# EAGLE design platform_smd2_map2 (EAGLE 6.5.0)
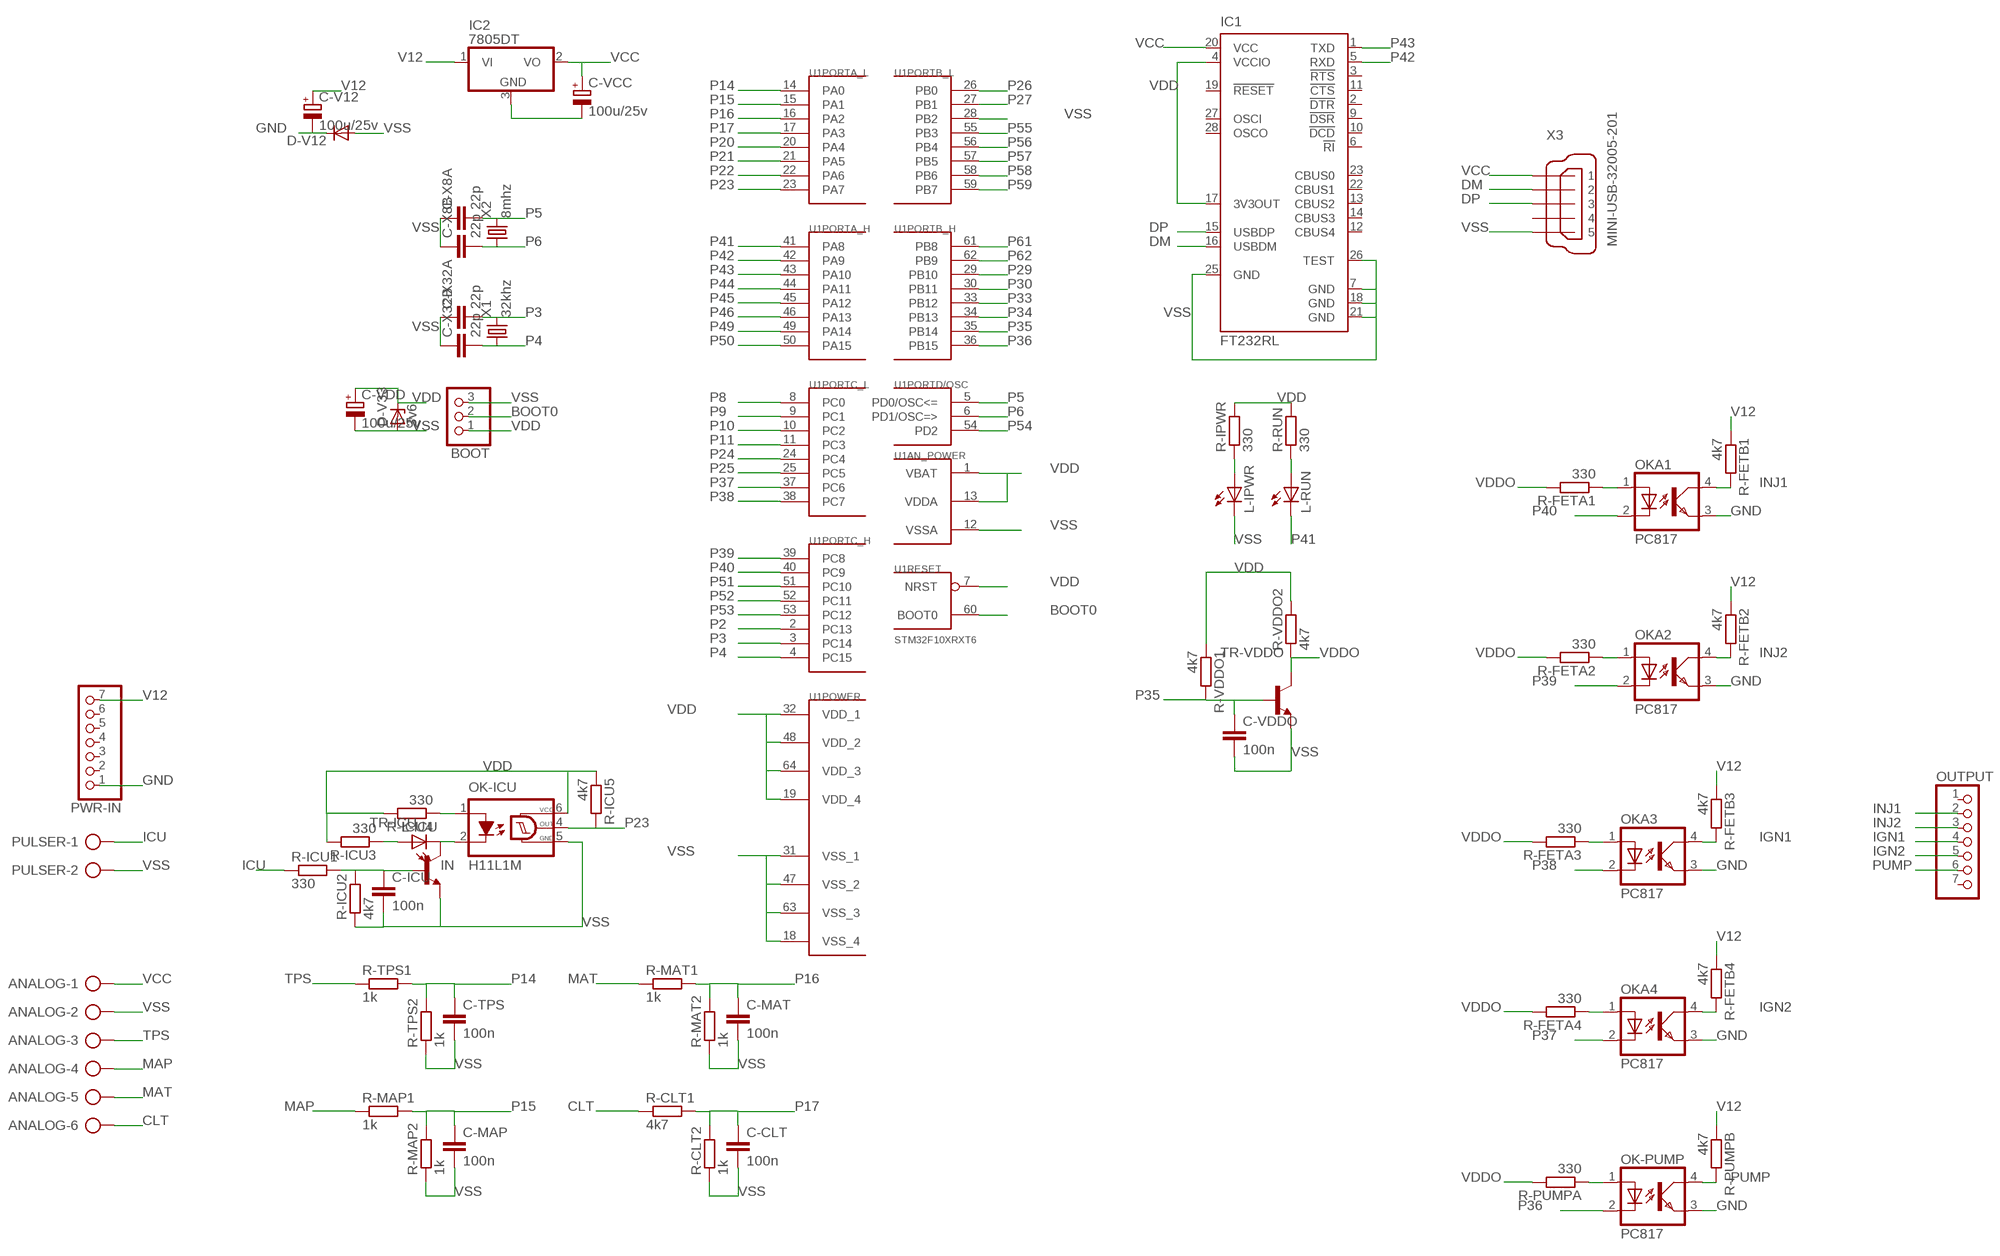
[diagram p0: schematic, sheet 1]

## Parts
ANALOG  AK300/6  [AK300/6]
BOOT  PINHD-1X3  [1X03]
C-CLT  100n  C-EUC1206  [C1206]
C-ICU  100n  C-EUC1206  [C1206]
C-MAP  100n  C-EUC1206  [C1206]
C-MAT  100n  C-EUC1206  [C1206]
C-TPS  100n  C-EUC1206  [C1206]
C-V12  100u/25v  CPOL-EUD  [PANASONIC_D]
C-VCC  100u/25v  CPOL-EUD  [PANASONIC_D]
C-VDD  100u/25v  CPOL-EUD  [PANASONIC_D]
C-VDDO  100n  C-EUC1206  [C1206]
C-X8A  22p  C-EUC1206  [C1206]
C-X8B  22p  C-EUC1206  [C1206]
C-X32A  22p  C-EUC1206  [C1206]
C-X32B  22p  C-EUC1206  [C1206]
D-V12  DIODE-SMB  [SMB]
D-V33  3v6  ZENER-DIODESMB  [SMB]
IC1  FT232RL  [SSOP28]
IC2  7805DT  [TO252]
L-ICU  LEDSMT1206  [1206]
L-IPWR  LEDSMT1206  [1206]
L-RUN  LEDSMT1206  [1206]
OK-ICU  H11L1M  [DIL06]
OK-PUMP  PC817  [DIL04]
OKA1  PC817  [DIL04]
OKA2  PC817  [DIL04]
OKA3  PC817  [DIL04]
OKA4  PC817  [DIL04]
OUTPUT  PINHD-1X7  [1X07]
PULSER  AK300/2  [AK300/2]
PWR-IN  PINHD-1X7  [1X07]
R-CLT1  4k7  R-EU_R1206  [R1206]
R-CLT2  1k  R-EU_R1206  [R1206]
R-FETA1  330  R-EU_R1206  [R1206]
R-FETA2  330  R-EU_R1206  [R1206]
R-FETA3  330  R-EU_R1206  [R1206]
R-FETA4  330  R-EU_R1206  [R1206]
R-FETB1  4k7  R-EU_R1206  [R1206]
R-FETB2  4k7  R-EU_R1206  [R1206]
R-FETB3  4k7  R-EU_R1206  [R1206]
R-FETB4  4k7  R-EU_R1206  [R1206]
R-ICU1  330  R-EU_R1206  [R1206]
R-ICU2  4k7  R-EU_R1206  [R1206]
R-ICU3  330  R-EU_R1206  [R1206]
R-ICU4  330  R-EU_R1206  [R1206]
R-ICU5  4k7  R-EU_R1206  [R1206]
R-IPWR  330  R-EU_R1206  [R1206]
R-MAP1  1k  R-EU_R1206  [R1206]
R-MAP2  1k  R-EU_R1206  [R1206]
R-MAT1  1k  R-EU_R1206  [R1206]
R-MAT2  1k  R-EU_R1206  [R1206]
R-PUMPA  330  R-EU_R1206  [R1206]
R-PUMPB  4k7  R-EU_R1206  [R1206]
R-RUN  330  R-EU_R1206  [R1206]
R-TPS1  1k  R-EU_R1206  [R1206]
R-TPS2  1k  R-EU_R1206  [R1206]
R-VDDO1  4k7  R-EU_M1206  [M1206]
R-VDDO2  4k7  R-EU_M1206  [M1206]
TR-ICU  MMBT3904LT1-NPN-SOT23-BEC  [SOT23-BEC]
TR-VDDO  MMBT3904LT1-NPN-SOT23-BEC  [SOT23-BEC]
U1  STM32F10XRXT6  [TQFP64]
X1  32khz  CRYSTALTC26V  [TC26V]
X2  8mhz  CRYSTALHC49U-V  [HC49U-V]
X3  MINI-USB-32005-201  [32005-201]

## Nets
BOOT0: BOOT.2 U1.60(RESET:BOOT0)
CLT: ANALOG.6 R-CLT1.1
DM: IC1.16(USBDM) X3.2
DP: IC1.15(USBDP) X3.3
GND: C-V12.- D-V12.C OK-PUMP.3(EMIT) OKA1.3(EMIT) OKA2.3(EMIT) OKA3.3(EMIT) OKA4.3(EMIT) PWR-IN.1
ICU: PULSER.1 R-ICU1.1
IGN1: OKA3.4(COL) OUTPUT.4 R-FETB3.2
IGN2: OKA4.4(COL) OUTPUT.5 R-FETB4.2
IN: L-ICU.C OK-ICU.2(C) TR-ICU.C
INJ1: OKA1.4(COL) OUTPUT.2 R-FETB1.2
INJ2: OKA2.4(COL) OUTPUT.3 R-FETB2.2
MAP: ANALOG.4 R-MAP1.1
MAT: ANALOG.5 R-MAT1.1
N$3: C-ICU.1 R-ICU1.2 R-ICU2.2 TR-ICU.B
N$5: OK-ICU.1(A) R-ICU4.1
N$6: L-ICU.A R-ICU3.1
N$7: L-IPWR.A R-IPWR.1
N$8: L-RUN.A R-RUN.1
N$9: OK-PUMP.1(A) R-PUMPA.1
N$12: OKA2.1(A) R-FETA2.1
N$13: OKA1.1(A) R-FETA1.1
N$15: OKA3.1(A) R-FETA3.1
N$17: OKA4.1(A) R-FETA4.1
P2: U1.2(PORTC_H:PC13)
P3: C-X32A.2 U1.3(PORTC_H:PC14) X1.2
P4: C-X32B.2 U1.4(PORTC_H:PC15) X1.1
P5: C-X8A.2 U1.5(PORTD/OSC:PD0/OSC<=) X2.2
P6: C-X8B.2 U1.6(PORTD/OSC:PD1/OSC=>) X2.1
P8: U1.8(PORTC_L:PC0)
P9: U1.9(PORTC_L:PC1)
P10: U1.10(PORTC_L:PC2)
P11: U1.11(PORTC_L:PC3)
P14: C-TPS.1 R-TPS1.2 R-TPS2.2 U1.14(PORTA_L:PA0)
P15: C-MAP.1 R-MAP1.2 R-MAP2.2 U1.15(PORTA_L:PA1)
P16: C-MAT.1 R-MAT1.2 R-MAT2.2 U1.16(PORTA_L:PA2)
P17: C-CLT.1 R-CLT1.2 R-CLT2.2 U1.17(PORTA_L:PA3)
P20: U1.20(PORTA_L:PA4)
P21: U1.21(PORTA_L:PA5)
P22: U1.22(PORTA_L:PA6)
P23: OK-ICU.4(OUT) R-ICU5.2 U1.23(PORTA_L:PA7)
P24: U1.24(PORTC_L:PC4)
P25: U1.25(PORTC_L:PC5)
P26: U1.26(PORTB_L:PB0)
P27: U1.27(PORTB_L:PB1)
P29: U1.29(PORTB_H:PB10)
P30: U1.30(PORTB_H:PB11)
P33: U1.33(PORTB_H:PB12)
P34: U1.34(PORTB_H:PB13)
P35: C-VDDO.1 R-VDDO1.2 TR-VDDO.B U1.35(PORTB_H:PB14)
P36: OK-PUMP.2(C) U1.36(PORTB_H:PB15)
P37: OKA4.2(C) U1.37(PORTC_L:PC6)
P38: OKA3.2(C) U1.38(PORTC_L:PC7)
P39: OKA2.2(C) U1.39(PORTC_H:PC8)
P40: OKA1.2(C) U1.40(PORTC_H:PC9)
P41: L-RUN.C U1.41(PORTA_H:PA8)
P42: IC1.5(RXD) U1.42(PORTA_H:PA9)
P43: IC1.1(TXD) U1.43(PORTA_H:PA10)
P44: U1.44(PORTA_H:PA11)
P45: U1.45(PORTA_H:PA12)
P46: U1.46(PORTA_H:PA13)
P49: U1.49(PORTA_H:PA14)
P50: U1.50(PORTA_H:PA15)
P51: U1.51(PORTC_H:PC10)
P52: U1.52(PORTC_H:PC11)
P53: U1.53(PORTC_H:PC12)
P54: U1.54(PORTD/OSC:PD2)
P55: U1.55(PORTB_L:PB3)
P56: U1.56(PORTB_L:PB4)
P57: U1.57(PORTB_L:PB5)
P58: U1.58(PORTB_L:PB6)
P59: U1.59(PORTB_L:PB7)
P61: U1.61(PORTB_H:PB8)
P62: U1.62(PORTB_H:PB9)
PUMP: OK-PUMP.4(COL) OUTPUT.6 R-PUMPB.2
TPS: ANALOG.3 R-TPS1.1
V12: C-V12.+ IC2.1(VI) PWR-IN.7 R-FETB1.1 R-FETB2.1 R-FETB3.1 R-FETB4.1 R-PUMPB.1
VCC: ANALOG.1 C-VCC.+ IC1.20(VCC) IC2.2(VO) X3.1
VDD: BOOT.1 C-VDD.+ D-V33.C IC1.4(VCCIO) IC1.17(3V3OUT) OK-ICU.6(VCC) R-ICU3.2 R-ICU4.2 R-ICU5.1 R-IPWR.2 R-RUN.2 R-VDDO1.1 R-VDDO2.2 U1.1(AN_POWER:VBAT) U1.7(RESET:NRST) U1.13(AN_POWER:VDDA) U1.19(POWER:VDD_4) U1.32(POWER:VDD_1) U1.48(POWER:VDD_2) U1.64(POWER:VDD_3)
VDDO: R-FETA1.2 R-FETA2.2 R-FETA3.2 R-FETA4.2 R-PUMPA.2 R-VDDO2.1 TR-VDDO.C
VSS: ANALOG.2 BOOT.3 C-CLT.2 C-ICU.2 C-MAP.2 C-MAT.2 C-TPS.2 C-VCC.- C-VDD.- C-VDDO.2 C-X8A.1 C-X8B.1 C-X32A.1 C-X32B.1 D-V12.A D-V33.A IC1.7(GND) IC1.18(GND) IC1.21(GND) IC1.25(GND) IC1.26(TEST) IC2.3(GND) L-IPWR.C OK-ICU.5(GND) PULSER.2 R-CLT2.1 R-ICU2.1 R-MAP2.1 R-MAT2.1 R-TPS2.1 TR-ICU.E TR-VDDO.E U1.12(AN_POWER:VSSA) U1.18(POWER:VSS_4) U1.28(PORTB_L:PB2) U1.31(POWER:VSS_1) U1.47(POWER:VSS_2) U1.63(POWER:VSS_3) X3.5
Unconnected: IC1.2(!DTR) IC1.3(!RTS) IC1.6(!RI) IC1.9(!DSR) IC1.10(!DCD) IC1.11(!CTS) IC1.12(CBUS4) IC1.13(CBUS2) IC1.14(CBUS3) IC1.19(!RESET) IC1.22(CBUS1) IC1.23(CBUS0) IC1.27(OSCI) IC1.28(OSCO) OUTPUT.1 OUTPUT.7 PWR-IN.2 PWR-IN.3 PWR-IN.4 PWR-IN.5 PWR-IN.6 X3.4

## Library data of the parts
ANALOG = con-ptr500:AK300/6: CONNECTOR; OC_FARNELL: unknown; OC_NEWARK: unknown
BOOT = pinhead:PINHD-1X3: PIN HEADER
C-CLT C-ICU C-MAP C-MAT C-TPS C-VDDO C-X8A C-X8B C-X32A C-X32B = resistor:C-EU: CAPACITOR, European symbol
C-V12 C-VCC C-VDD = resistor:CPOL-EU: POLARIZED CAPACITOR, European symbol
D-V12 = diode:DIODE-: DIODE
D-V33 = diode:ZENER-DIODE: Z-Diode
IC1 = ftdichip:FT232R: Source: http://www.ftdichip.com/Documents/DataSheets/DS_FT232R_v104.pdf; MPN: FT232RL; OC_FARNELL: 1146032; OC_NEWARK: 91K9918
IC2 = linear:78*: Positive VOLTAGE REGULATOR Source: http://cache.national.com/ds/LM/LM78L05.pdf http://www.fairchildsemi.com/ds/LM/LM7805.pdf
L-ICU L-IPWR L-RUN = led:LED: LED OSRAM: - CHIPLED LG R971, LG N971, LY N971, LG Q971, LY Q971, LO R971, LY R971 LH N974, LH R974 LS Q976, LO Q976, LY Q976 LO Q996 - Hyper CHIPLED LW Q18S LB Q993, LB Q99A, LB R99A - SideLED LS A670, LO A670, LY A670, LG A670, LP A670 LB A673, LV A673, LT A673, LW A673 LH A674 LY A675 LS A676, LA A676, LO A676, LY A676, LW A676 LS A679, LY A679, LG A679 - Hyper Micro SIDELED® LS Y876, LA Y876, LO Y876, LY Y876 LT Y87S - SmartLED LW L88C, LW L88S LB L89C, LB L89S, LG L890 LS L89K, LO L89K, LY L89K LS L896, LA L896, LO L896, LY L896 - TOPLED LS T670, LO T670, LY T670, LG T670, LP T670 LSG T670, LSP T670, LSY T670, LOP T670, LYG T670 LG T671, LOG T671, LSG T671 LB T673, LV T673, LT T673, LW T673 LH T674 LS T676, LA T676, LO T676, LY T676, LB T676, LH T676, LSB T676, LW T676 LB T67C, LV T67C, LT T67C, LS T67K, LO T67K, LY T67K, LW E67C LS E67B, LA E67B, LO E67B, LY E67B, LB E67C, LV E67C, LT E67C LW T67C LS T679, LY T679, LG T679 LS T770, LO T770, LY T770, LG T770, LP T770 LB T773, LV T773, LT T773, LW T773 LH T774 LS E675, LA E675, LY E675, LS T675 LS T776, LA T776, LO T776, LY T776, LB T776 LHGB T686 LT T68C, LB T68C - Hyper Mini TOPLED® LB M676 - Mini TOPLED Santana® LG M470 LS M47K, LO M47K, LY M47K Source: http://www.osram.convergy.de LUXEON: - LUMILED® LXK2-PW12-R00, LXK2-PW12-S00, LXK2-PW14-U00, LXK2-PW14-V00 LXK2-PM12-R00, LXK2-PM12-S00, LXK2-PM14-U00 LXK2-PE12-Q00, LXK2-PE12-R00, LXK2-PE12-S00, LXK2-PE14-T00, LXK2-PE14-U00 LXK2-PB12-K00, LXK2-PB12-L00, LXK2-PB12-M00, LXK2-PB14-N00, LXK2-PB14-P00, LXK2-PB14-Q00 LXK2-PR12-L00, LXK2-PR12-M00, LXK2-PR14-Q00, LXK2-PR14-R00 LXK2-PD12-Q00, LXK2-PD12-R00, LXK2-PD12-S00 LXK2-PH12-R00, LXK2-PH12-S00 LXK2-PL12-P00, LXK2-PL12-Q00, LXK2-PL12-R00 Source: www.luxeon.com KINGBRIGHT: KA-3528ASYC Source: www.kingbright.com
OK-ICU = optocoupler:H11L*M: 6-Pin DIP Optocoupler Source: http://www.fairchildsemi.com/ds/H1/H11L2-M.pdf; MF: FAIRCHILD SEMICONDUCTOR; MPN: H11L1-M; OC_FARNELL: 1021127; OC_NEWARK: 72K8643
OK-PUMP OKA1-OKA4 = optocoupler:PC817: SHARP OPTO COUPLER; MPN: PC817X4J000F; OC_FARNELL: 9707727; OC_NEWARK: 97K7059
OUTPUT PWR-IN = pinhead:PINHD-1X7: PIN HEADER
PULSER = con-ptr500:AK300/2: CONNECTOR; OC_FARNELL: unknown; OC_NEWARK: unknown
R-CLT1 R-CLT2 R-FETA1-R-FETA4 R-FETB1-R-FETB4 R-ICU1-R-ICU5 R-IPWR R-MAP1 R-MAP2 R-MAT1 R-MAT2 R-PUMPA R-PUMPB R-RUN R-TPS1 R-TPS2 R-VDDO1 R-VDDO2 = resistor:R-EU_: RESISTOR, European symbol
TR-ICU TR-VDDO = transistor:*-NPN-: NPN Transistror BF959 corrected 2008.03.06
U1 = stm32:STM32F10XRXT6: STM32F101/103 64pin LQFP
X1 = crystal:CRYSTAL: CRYSTAL; OC_FARNELL: unknown; OC_NEWARK: unknown
X2 = crystal:CRYSTAL: CRYSTAL; OC_FARNELL: 1666969; OC_NEWARK: unknown
X3 = con-cypressindustries:MINI-USB-: MINI USB-B Conector Source: www.cypressindustries.com; OC_FARNELL: unknown; OC_NEWARK: unknown

## Board
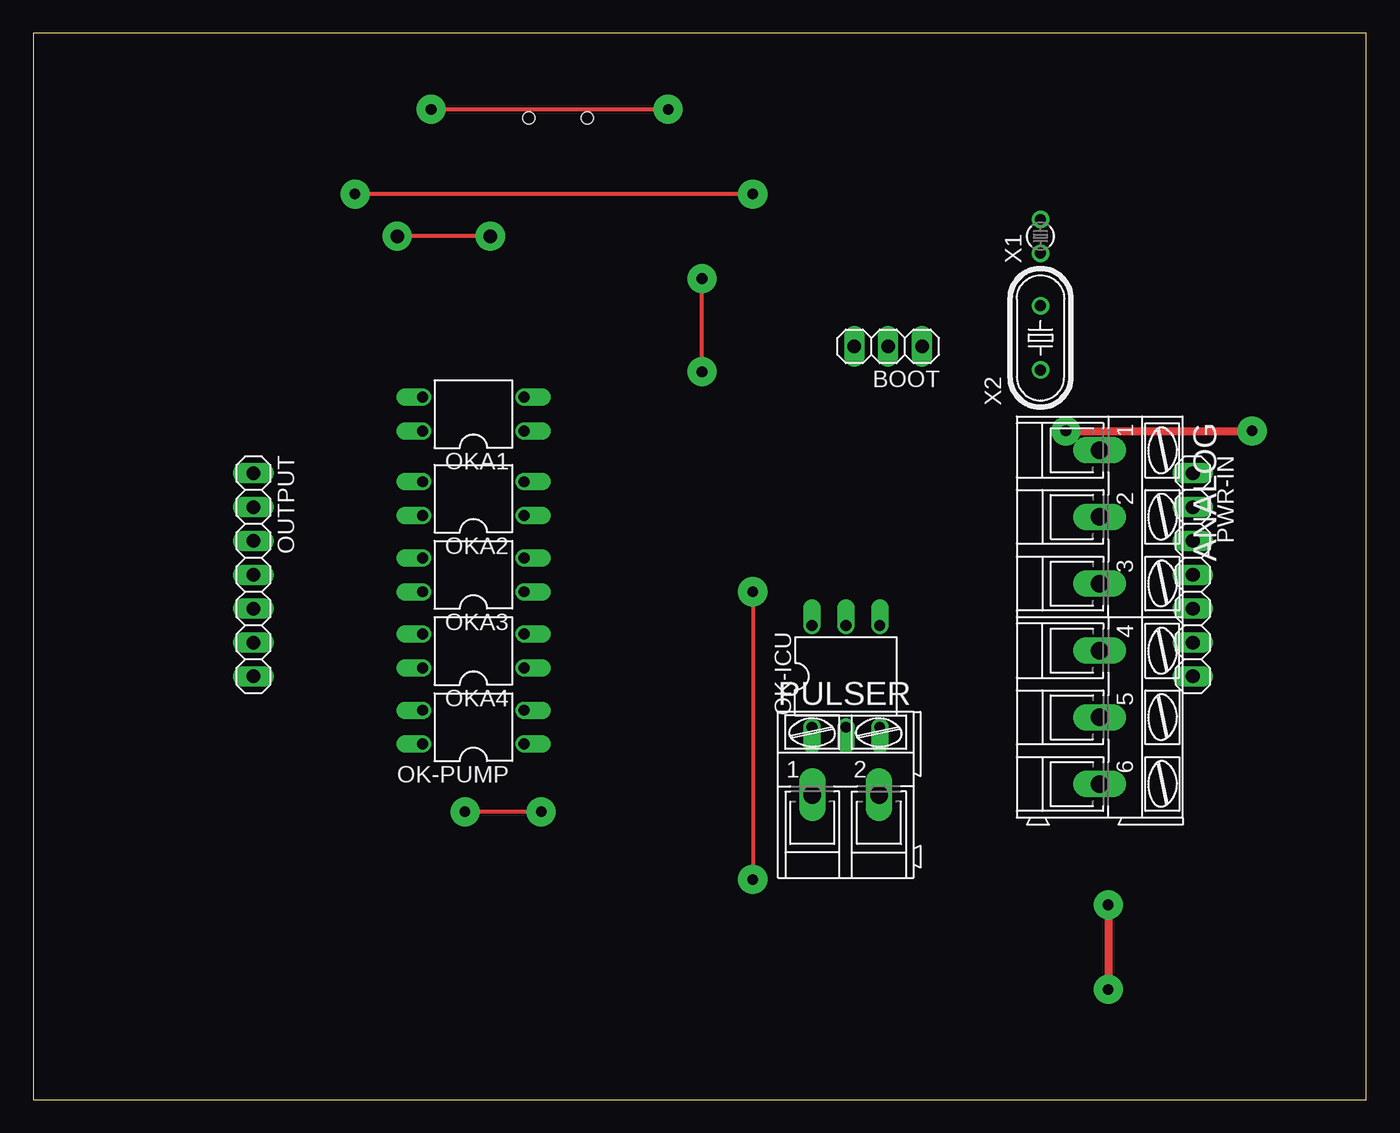
[diagram p1: board, top side]
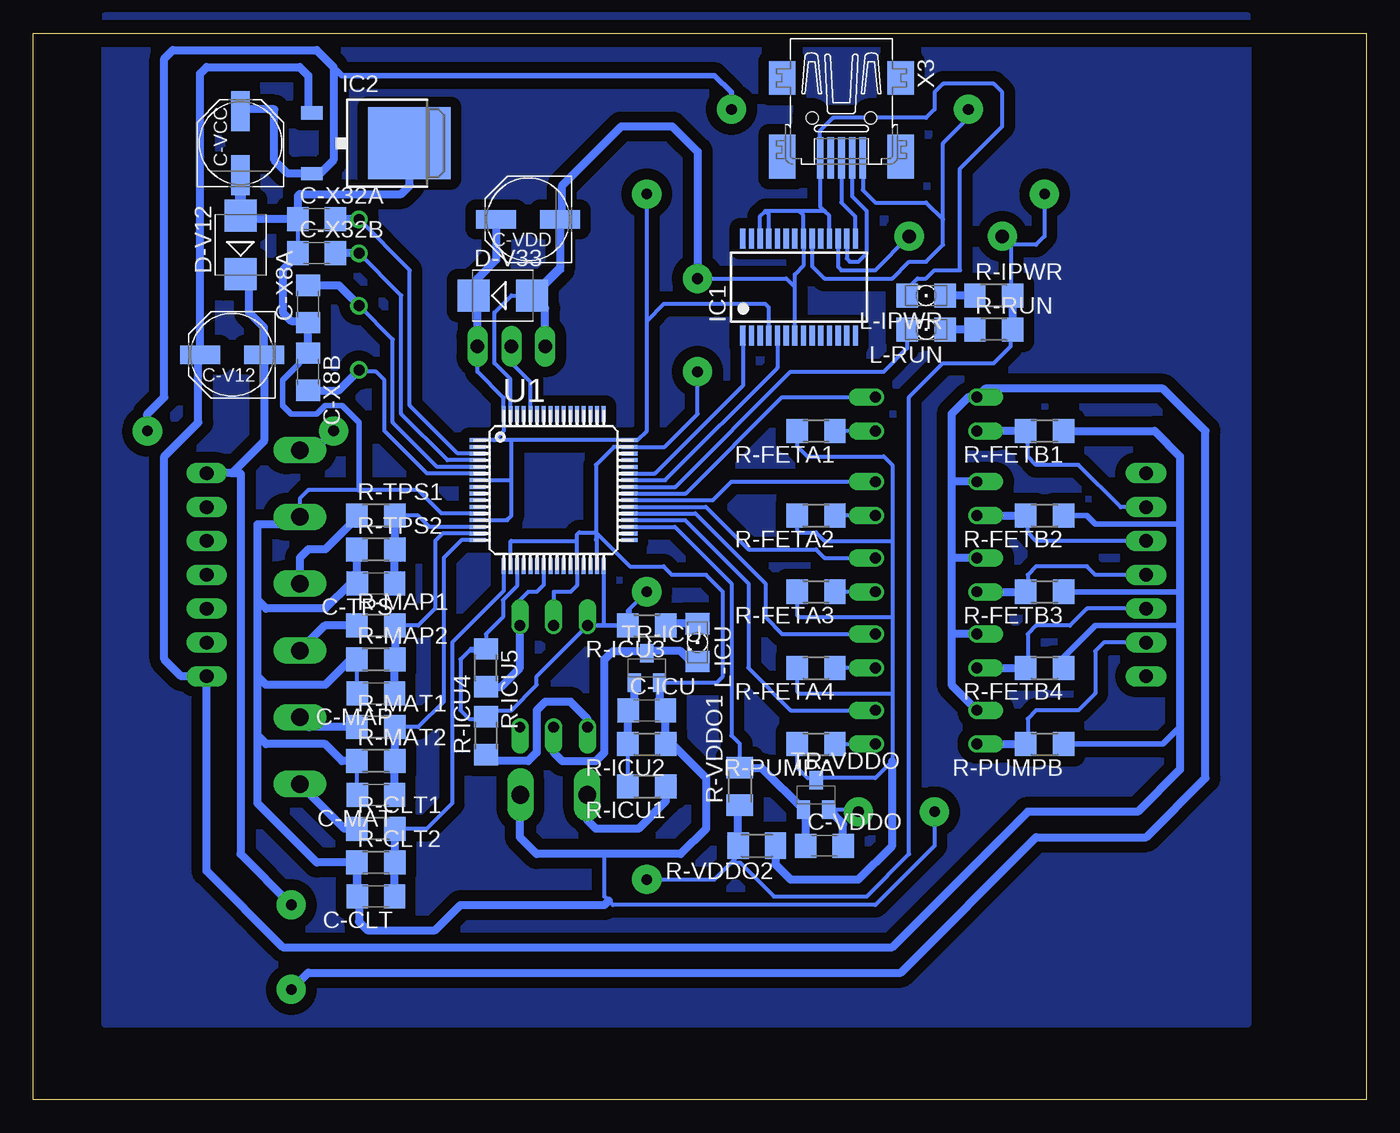
[diagram p2: board, bottom side, seen from below]

Size 100 x 80 mm. Coordinates in mm from the lower left corner, seen from the top.
Outline: 0,0 100,0 100,80 0,80 0,0
Copper layers (1*16): Top 0.035mm / dielectric 1.5mm / Bottom 0.035mm
Design rules "default": minimum track width 10mil, minimum drill 24mil, track to track 8mil, track to pad 8mil, pad to pad 8mil, via to via 8mil, smd to smd 8mil, copper to edge 40mil, drill to drill 8mil, minimum pad ring 10mil, minimum via ring 8mil, stop-mask expansion 4mil, vias tented up to drill 0mil, thermal gap 10mil

### Footprints (pad centres in the part's own frame; a part is rotated, then mirrored left to right if it is on the bottom)
AK300/6 = drill 1.321 long: 1 -12.522,0; 2 -7.518,0; 3 -2.515,0; 4 2.515,0; 5 7.518,0; 6 12.522,0
1X03 = drill 1.016 long: 1 -2.54,0; 2 0,0; 3 2.54,0
C1206 = smd 1.6 x 1.8: 1 -1.4,0; 2 1.4,0
PANASONIC_D = smd 3 x 1.4: + 2.4,0; - -2.4,0
SMB = smd 2.4 x 2.4: A 2.2,0; C -2.2,0
SSOP28 = smd 0.4 x 1.5: 1 -4.225,-3.625; 2 -3.575,-3.625; 3 -2.925,-3.625; 4 -2.275,-3.625; 5 -1.625,-3.625; 6 -0.975,-3.625; 7 -0.325,-3.625; 8 0.325,-3.625; 9 0.975,-3.625; 10 1.625,-3.625; 11 2.275,-3.625; 12 2.925,-3.625; 13 3.575,-3.625; 14 4.225,-3.625; 15 4.225,3.625; 16 3.575,3.625; 17 2.925,3.625; 18 2.275,3.625; 19 1.625,3.625; 20 0.975,3.625; 21 0.325,3.625; 22 -0.325,3.625; 23 -0.975,3.625; 24 -1.625,3.625; 25 -2.275,3.625; 26 -2.925,3.625; 27 -3.575,3.625; 28 -4.225,3.625
TO252 = smd 1 x 1.6: 1 -2.28,-4.8; 2 2.28,-4.8 | smd 5.4 x 6.2: 3 0,2.5
1206 = smd 1.6 x 1.803: A -1.422,0; C 1.422,0
DIL06 = drill 0.813 offset: 1 -2.54,-3.81; 2 0,-3.81; 3 2.54,-3.81; 4 2.54,3.81; 5 0,3.81; 6 -2.54,3.81
DIL04 = drill 0.813 offset: 1 -1.27,-3.81; 2 1.27,-3.81; 3 1.27,3.81; 4 -1.27,3.81
1X07 = drill 1.016 long: 1 -7.62,0; 2 -5.08,0; 3 -2.54,0; 4 0,0; 5 2.54,0; 6 5.08,0; 7 7.62,0
AK300/2 = drill 1.321 long: 1 -2.515,0; 2 2.489,0
R1206 = smd 1.6 x 1.803: 1 -1.422,0; 2 1.422,0
M1206 = smd 1.6 x 2: 1 -1.4,0; 2 1.4,0
SOT23-BEC = smd 1 x 1.4: B -0.95,-1.1; C 0,1.1; E 0.95,-1.1
TQFP64 = smd 1.2 x 0.3: 1 -5.7,3.75; 2 -5.7,3.25; 3 -5.7,2.75; 4 -5.7,2.25; 5 -5.7,1.75; 6 -5.7,1.25; 7 -5.7,0.75; 8 -5.7,0.25; 9 -5.7,-0.25; 10 -5.7,-0.75; 11 -5.7,-1.25; 12 -5.7,-1.75; 13 -5.7,-2.25; 14 -5.7,-2.75; 15 -5.7,-3.25; 16 -5.7,-3.75; 33 5.7,-3.75; 34 5.7,-3.25; 35 5.7,-2.75; 36 5.7,-2.25; 37 5.7,-1.75; 38 5.7,-1.25; 39 5.7,-0.75; 40 5.7,-0.25; 41 5.7,0.25; 42 5.7,0.75; 43 5.7,1.25; 44 5.7,1.75; 45 5.7,2.25; 46 5.7,2.75; 47 5.7,3.25; 48 5.7,3.75 | smd 0.3 x 1.2: 17 -3.75,-5.7; 18 -3.25,-5.7; 19 -2.75,-5.7; 20 -2.25,-5.7; 21 -1.75,-5.7; 22 -1.25,-5.7; 23 -0.75,-5.7; 24 -0.25,-5.7; 25 0.25,-5.7; 26 0.75,-5.7; 27 1.25,-5.7; 28 1.75,-5.7; 29 2.25,-5.7; 30 2.75,-5.7; 31 3.25,-5.7; 32 3.75,-5.7; 49 3.75,5.7; 50 3.25,5.7; 51 2.75,5.7; 52 2.25,5.7; 53 1.75,5.7; 54 1.25,5.7; 55 0.75,5.7; 56 0.25,5.7; 57 -0.25,5.7; 58 -0.75,5.7; 59 -1.25,5.7; 60 -1.75,5.7; 61 -2.25,5.7; 62 -2.75,5.7; 63 -3.25,5.7; 64 -3.75,5.7
TC26V = drill 0.813: 1 -1.27,0; 2 1.27,0
HC49U-V = drill 0.813: 1 -2.413,0; 2 2.413,0
32005-201 = smd 3.1 x 0.5: 1 3,1.6; 2 3,0.8; 3 3,0; 4 3,-0.8; 5 3,-1.6 | smd 2.5 x 2: M1 -3,-4.45; M2 -3,4.45 | smd 3.3 x 2: M3 2.9,4.45; M4 2.9,-4.45 | hole 0.9: 0,2.2; 0,-2.2

### Placement (x,y rotation side)
ANALOG  80.01,36.2 270 top
BOOT  64.14,56.52 180 top
C-CLT  74.3,15.24 180 bottom
C-ICU  53.98,29.21 0 bottom
C-MAP  74.3,30.48 180 bottom
C-MAT  74.3,22.86 180 bottom
C-TPS  74.3,38.73 180 bottom
C-V12  85.09,55.88 180 bottom
C-VCC  84.45,71.75 90 bottom
C-VDD  62.87,66.04 180 bottom
C-VDDO  40.64,19.05 0 bottom
C-X8A  79.38,59.69 90 bottom
C-X8B  79.38,54.61 270 bottom
C-X32A  78.74,66.04 0 bottom
C-X32B  78.74,63.5 0 bottom
D-V12  84.45,64.14 90 bottom
D-V33  64.77,60.33 0 bottom
IC1  42.55,60.96 0 bottom
IC2  74.3,71.75 270 bottom
L-ICU  50.16,34.29 270 bottom
L-IPWR  33.02,60.33 180 bottom
L-RUN  33.02,57.78 180 bottom
OK-ICU  60.96,31.75 0 top
OK-PUMP  33.02,27.94 90 top
OKA1  33.02,51.44 90 top
OKA2  33.02,45.09 90 top
OKA3  33.02,39.37 90 top
OKA4  33.02,33.66 90 top
OUTPUT  16.51,39.37 270 top
PULSER  60.96,22.86 0 top
PWR-IN  87,39.37 270 top
R-CLT1  74.3,20.32 0 bottom
R-CLT2  74.3,17.78 0 bottom
R-FETA1  41.27,50.16 180 bottom
R-FETA2  41.27,43.81 180 bottom
R-FETA3  41.27,38.1 180 bottom
R-FETA4  41.27,32.38 180 bottom
R-FETB1  24.13,50.16 180 bottom
R-FETB2  24.13,43.81 180 bottom
R-FETB3  24.13,38.1 180 bottom
R-FETB4  24.13,32.38 180 bottom
R-ICU1  53.98,23.5 180 bottom
R-ICU2  53.98,26.67 180 bottom
R-ICU3  53.98,35.56 180 bottom
R-ICU4  66.04,27.3 90 bottom
R-ICU5  66.04,32.38 270 bottom
R-IPWR  27.94,60.33 0 bottom
R-MAP1  74.3,35.56 0 bottom
R-MAP2  74.3,33.02 0 bottom
R-MAT1  74.3,27.94 0 bottom
R-MAT2  74.3,25.4 0 bottom
R-PUMPA  41.27,26.67 180 bottom
R-PUMPB  24.13,26.67 180 bottom
R-RUN  27.94,57.78 0 bottom
R-TPS1  74.3,43.81 0 bottom
R-TPS2  74.3,41.27 0 bottom
R-VDDO1  46.99,23.5 90 bottom
R-VDDO2  45.72,19.05 180 bottom
TR-ICU  53.98,32.38 0 bottom
TR-VDDO  41.27,22.86 0 bottom
U1  60.96,45.72 0 bottom
X1  75.56,64.77 90 top
X2  75.56,57.15 90 top
X3  39.37,73.66 270 bottom

### Tracks (layer width: path | path; a pad name or v marks a point on that pad's centre or on a via)
BOOT0
  Bottom 0.305: U1.60 62.71,53.82 64.14,55.24 BOOT.2
CLT
  Bottom 0.61: R-CLT1.1 76.66,20.32 ANALOG.6
DM
  Bottom 0.305: X3.2 38.57,67.78 37.47,66.67 37.47,63.5 38.1,62.87 38.73,62.87 38.97,63.1 IC1.16
DP
  Bottom 0.305: X3.3 39.37,67.31 38.32,66.26 IC1.15
GND  (via drill 0.8 pad 2.18)
  Top 0.61: v80.64,14.61 v80.64,8.26
  Bottom 0.61: 31.11,46.35 31.11,51.44 29.84,52.7 OKA1.3 28.57,53.34 15.24,53.34 12.06,50.16 12.06,24.13 16.51,19.68 24.77,19.68 34.92,9.53 79.38,9.53 v80.64,8.26 | 31.11,46.35 31.11,40.64 | 31.11,40.64 31.11,34.92 | 31.11,34.92 31.11,31.11 OK-PUMP.3 | OKA4.3 31.11,34.92 | OKA3.3 31.11,40.64 | OKA2.3 31.11,46.35 | D-V12.C 83.82,61.3 83.82,59.05 82.69,57.92 C-V12.- 82.69,49.39 85.09,46.99 | 85.09,46.99 PWR-IN.1 | 85.09,46.99 84.45,46.99 84.45,18.41 v80.64,14.61
ICU
  Bottom 0.61: R-ICU1.1 52.55,22.38 54.61,20.32 57.78,20.32 58.42,20.95 58.42,22.84 PULSER.1
IGN1
  Bottom 0.305: OUTPUT.4 20.32,39.37 20.95,40.01 24.77,40.01 25.4,39.37 25.4,37.95 | 25.4,37.47 25.4,37.95 | 25.4,37.95 R-FETB3.2
  Bottom 0.61: OKA3.4 R-FETB3.2
IGN2
  Bottom 0.305: OUTPUT.5 20.95,36.83 22.23,35.56 24.77,35.56 25.4,34.92 25.4,32.54 R-FETB4.2
  Bottom 0.61: OKA4.4 R-FETB4.2
IN
  Bottom 0.61: L-ICU.C 50.65,32.87 51.44,33.66 53.8,33.66 TR-ICU.C 54.15,33.66 56.52,33.66 57.15,33.02 57.15,26.04 57.78,25.4 60.33,25.4 60.96,26.04 OK-ICU.2
INJ1
  Bottom 0.305: OUTPUT.2 18.41,44.45 21.59,47.62 24.77,47.62 25.4,48.26 25.4,50.01 R-FETB1.2
  Bottom 0.61: R-FETB1.2 OKA1.4
INJ2
  Bottom 0.305: OUTPUT.3 24.77,41.91 25.4,42.55 25.4,43.66 R-FETB2.2
  Bottom 0.61: OKA2.4 R-FETB2.2
MAP
  Bottom 0.61: R-MAP1.1 78.13,35.56 ANALOG.4
MAT
  Bottom 0.61: R-MAT1.1 79.27,27.94 ANALOG.5
N$1
  pour Bottom (isolate 0.813): 8.89,81.28 94.61,81.28 94.61,5.71 8.89,5.71
N$3
  Bottom 0.305: R-ICU1.2 R-ICU2.2
  Bottom 0.61: TR-ICU.B 54.92,29.66 C-ICU.1 55.4,29.19 R-ICU2.2
N$5
  Bottom 0.61: OK-ICU.1 58.42,28.57 59.69,29.84 61.59,29.84 62.23,29.21 62.23,26.04 62.87,25.4 65.56,25.4 R-ICU4.1
N$6
  Bottom 0.61: L-ICU.A 52.4,35.71 R-ICU3.1
N$7
  Bottom 0.61: R-IPWR.1 L-IPWR.A
N$8
  Bottom 0.61: R-RUN.1 L-RUN.A
N$9
  Bottom 0.305: R-PUMPA.1 OK-PUMP.1
N$12
  Bottom 0.305: OKA2.1 R-FETA2.1
N$13
  Bottom 0.305: OKA1.1 R-FETA1.1
N$15
  Bottom 0.305: OKA3.1 R-FETA3.1
N$17
  Bottom 0.305: OKA4.1 R-FETA4.1
P3
  Bottom 0.305: U1.3 68.16,48.47 71.75,52.07 71.75,62.23 X1.2
  Bottom 0.61: X1.2 C-X32A.2
P4
  Bottom 0.305: U1.4 68.92,47.97 72.39,51.44 72.39,60.33 X1.1
  Bottom 0.61: X1.1 C-X32B.2
P5
  Bottom 0.305: U1.5 69.69,47.47 73.03,50.8 73.03,57.02 X2.2
  Bottom 0.61: C-X8A.2 77.09,61.09 X2.2
P6
  Bottom 0.305: U1.6 70.47,46.97 73.66,50.16 73.66,53.98 74.3,54.61 75.44,54.61 X2.1
  Bottom 0.61: C-X8B.2 77.09,53.21 X2.1
P14
  Bottom 0.305: U1.14 70.28,42.97 71.12,43.81 R-TPS1.2
  Bottom 0.61: C-TPS.1 72.89,41.25 R-TPS2.2 R-TPS1.2
P15
  Bottom 0.305: U1.15 69.29,42.47 69.85,41.91 69.85,36.83 71.12,35.56 R-MAP1.2
  Bottom 0.61: C-MAP.1 72.89,33.52 | 72.89,33.52 73.03,33.66 | R-MAP1.2 R-MAP2.2 72.87,33.5 72.89,33.52
P16
  Bottom 0.305: U1.16 67.89,41.97 69.22,40.64 69.22,29.84 71.12,27.94 R-MAT1.2
  Bottom 0.61: C-MAT.1 72.89,25.38 R-MAT2.2 R-MAT1.2 | R-MAT1.2 72.87,28.42 73.03,28.57 73.03,28.09 R-MAT1.2
P17
  Bottom 0.305: U1.17 64.71,38.16 68.58,34.29 68.58,22.23 70.48,20.32 R-CLT1.2
  Bottom 0.61: C-CLT.1 72.89,17.76 R-CLT2.2 R-CLT1.2
P23
  Bottom 0.305: U1.23 61.71,38.62 62.23,38.1 62.87,38.1 63.5,37.47 OK-ICU.4
  Bottom 0.61: R-ICU5.2 64.92,30.96 63.5,32.38 OK-ICU.4
P35
  Bottom 0.305: U1.35 51.86,42.97 47.62,38.73 47.62,27.3 46.99,26.67 R-VDDO1.2
  Bottom 0.61: C-VDDO.1 42.04,21.57 TR-VDDO.B 45.36,24.89 R-VDDO1.2
P36
  Bottom 0.305: U1.36 51.09,43.47 46.35,38.73 46.35,32.38 43.18,29.21 OK-PUMP.2
P37
  Bottom 0.305: U1.37 50.32,43.97 45.09,38.73 45.09,36.2 43.81,34.92 OKA4.2
P38
  Bottom 0.305: U1.38 49.55,44.47 46.35,41.27 41.27,41.27 40.64,40.64 OKA3.2
P39
  Bottom 0.305: U1.39 49.01,44.97 47.62,46.35 OKA2.2
P40
  Bottom 0.305: U1.40 51.05,45.47 43.81,52.7 OKA1.2
P41
  Bottom 0.305: 34.29,57.63 L-RUN.C 34.44,56.36 36.2,54.61 43.18,54.61 51.82,45.97 U1.41
P42
  Bottom 0.305: U1.42 52.59,46.47 44.17,54.89 IC1.5
P43
  Bottom 0.305: U1.43 53.36,46.97 46.77,53.56 IC1.1
PUMP
  Bottom 0.305: OUTPUT.6 19.68,34.29 20.32,33.66 20.32,30.48 21.59,29.21 24.77,29.21 25.4,28.57 25.4,26.82 R-PUMPB.2
  Bottom 0.61: OK-PUMP.4 R-PUMPB.2
TPS
  Bottom 0.61: R-TPS1.1 75.72,43.66 78.11,41.27 79.38,41.27 80.01,40.64 ANALOG.3
V12
  Bottom 0.406: 13.97,48.26 13.97,43.18 | 13.97,43.18 13.97,38.1 | 13.97,38.1 13.97,35.56 | 13.97,35.56 13.97,27.94 15.24,26.67 R-PUMPB.1 | R-FETB4.1 22.71,33.17 20.32,35.56 13.97,35.56 | R-FETB3.1 13.97,38.1 | R-FETB2.1 20.95,43.81 20.32,43.18 13.97,43.18
  Bottom 0.61: PWR-IN.7 87.63,31.75 | 87.63,31.75 88.9,31.75 90.17,33.02 90.17,48.26 87.63,50.8 87.63,55.74 C-V12.+ 87.49,76.97 87,77.47 80.01,77.47 79.38,76.83 79.38,74.31 IC2.1 | R-FETB1.1 15.88,50.16 13.97,48.26 13.97,24.77 17.14,21.59 25.4,21.59 35.56,11.43 81.28,11.43 87,17.14 87,31.11 87.63,31.75
VCC  (via drill 0.8 pad 2.18)
  Top 0.305: v29.84,74.3 v47.62,74.3
  Top 0.61: v77.47,50.16 v91.44,50.16
  Bottom 0.305: X3.1 37.77,68.25 36.83,67.31 33.02,67.31 31.75,66.04 | IC1.20 41.57,62.52 40.64,61.59 35.56,61.59 34.29,62.87 33.02,62.87 31.75,64.14 31.75,66.04 | 31.75,66.04 31.75,71.75 29.84,73.66 v29.84,74.3
  Bottom 0.406: v47.62,74.3 47.62,75.56 48.9,76.83 76.83,76.83 77.47,77.47
  Bottom 0.61: C-VCC.+ 84.31,74.3 81.92,74.3 81.92,70.48 80.91,69.47 IC2.2 78.48,69.47 77.47,70.48 77.47,77.47 78.74,78.74 89.53,78.74 90.17,78.11 90.17,52.7 91.44,51.44 v91.44,50.16 | ANALOG.1 78.92,48.72 v77.47,50.16
VDD  (via drill 0.7 pad 2.18, 0.8 pad 2.18, 1)
  Top 0.305: v34.29,64.77 v27.3,64.77 | v53.98,67.94 v24.13,67.94 | v53.98,38.1 v53.98,16.51
  Bottom 0.305: 57.15,35.56 R-ICU3.2 55.4,36.68 55.24,36.83 | 57.15,35.56 OK-ICU.6 | 66.04,34.29 R-ICU5.1 67.16,33.81 67.31,33.66 | U1.32 57.21,35.62 57.15,35.56 | 66.19,28.57 67.31,28.57 67.94,29.21 67.94,33.02 67.31,33.66 | 66.19,28.57 R-ICU4.2 65.56,29.21 65.41,29.21 | BOOT.1 66.67,54.61 64.71,52.65 U1.64 64.71,50.16 65.41,49.47 | IC1.17 39.62,62.48 39.37,62.23 36.83,62.23 v34.29,64.77 | v27.3,64.77 26.67,64.14 | 26.67,64.14 26.67,60.48 R-IPWR.2 | 47.62,17.78 46.99,18.41 46.99,18.92 R-VDDO2.2 | U1.13 64.42,43.47 64.42,43.52 64.14,43.81 64.14,46.35 | 64.14,49.47 U1.48 54.67,49.47 53.98,50.16 53.98,58.42 | 64.14,49.47 65.41,49.47 | 65.41,49.47 U1.1 | U1.7 64.25,46.47 64.14,46.35 | 64.14,46.35 64.14,49.47 | IC1.4 44.82,59.42 45.09,59.69 52.7,59.69 53.98,58.42 | 53.98,58.42 v53.98,67.94 | v24.13,67.94 24.13,64.77 24.77,64.14 26.67,64.14 | U1.19 63.71,38.52 64.77,37.47 64.77,36.2 66.04,34.92 66.04,34.29 | 66.04,34.29 66.67,33.66 67.31,33.66 | 66.19,28.57 66.04,28.57 65.41,29.21 | 65.41,29.21 64.14,29.21 62.23,31.11 62.23,31.75 OK-ICU.6 | OK-ICU.6 55.24,35.56 55.24,36.83 | 55.24,36.83 v53.98,38.1 | v53.98,16.51 48.9,16.51 47.62,17.78 | 47.62,17.78 46.99,17.78 44.45,15.24 37.47,15.24 34.29,18.41 34.29,52.7 31.75,55.24 27.94,55.24 26.67,56.52 26.67,57.63 R-RUN.2
  Bottom 0.61: R-RUN.2 R-IPWR.2 | R-VDDO2.2 47.12,21.96 R-VDDO1.1 | C-VDD.+ 65.27,63.01 66.67,61.59 66.67,60.62 D-V33.C 66.67,60.03 BOOT.1
VDDO
  Bottom 0.305: R-FETA1.2 42.7,49.05 41.91,48.26 36.2,48.26 35.56,47.62 35.56,41.91 | 35.56,41.91 35.56,36.2 | 35.56,36.2 35.56,30.48 | 35.56,30.48 35.56,25.4 36.83,24.13 41.1,24.13 TR-VDDO.C 41.45,24.13 41.91,24.13 42.7,24.92 R-PUMPA.2 | R-FETA4.2 42.7,30.63 42.55,30.48 35.56,30.48 | R-FETA3.2 42.7,36.35 42.55,36.2 35.56,36.2 | R-FETA2.2 42.7,42.7 42.55,42.55 41.27,42.55 40.64,41.91 35.56,41.91
  Bottom 0.61: R-VDDO2.1 44.32,17.65 43.18,16.51 38.1,16.51 35.56,19.05 35.56,25.4
VSS  (via drill 0.8 pad 2.18)
  Top 0.305: v38.1,21.59 v32.38,21.59 | v50.16,54.61 v50.16,61.59
  Bottom 0.305: C-X32B.1 C-X32A.1 | C-MAT.2 75.69,25.38 R-MAT2.1 | C-MAP.2 75.69,33 R-MAP2.1 | 80.01,43.81 ANALOG.2 | OK-ICU.5 60.96,38.1 59.69,38.1 59.21,38.58 U1.28 59.21,41.91 | 59.21,41.91 59.21,42.39 59.05,42.55 57.78,42.55 57.71,42.47 | TR-ICU.E 48.73,31.29 48.26,31.75 48.26,38.1 49.53,39.37 52.07,39.37 52.7,40.01 55.24,40.01 57.71,42.47 | U1.31 57.71,41.91 | 57.71,41.91 57.71,42.47 | IC1.18 40.27,66.31 40.64,66.67 | 40.64,66.67 42.55,66.67 | 42.55,66.67 45.09,66.67 | IC1.25 44.82,66.41 45.09,66.67 | IC1.26 45.47,66.29 45.09,66.67 | 42.55,66.67 42.22,66.35 IC1.21 42.22,62.55 42.87,61.91 42.87,60.96 | 40.64,66.67 40.97,67 X3.5 40.97,72.69 40.01,73.66 33.02,73.66 32.38,74.3 32.38,75.56 31.75,76.2 27.94,76.2 27.3,75.56 27.3,73.03 30.48,69.85 30.48,62.23 32.38,62.23 33.02,61.59 33.66,61.59 34.44,60.81 L-IPWR.C | TR-VDDO.E 38.27,21.76 v38.1,21.59 | v32.38,21.59 32.38,19.05 36.83,14.61 56.52,14.61 56.83,14.92 57.15,15.24 57.15,18.41 | IC1.7 42.87,60.96 | 57.71,41.91 57.78,41.98 57.78,47.62 56.44,48.97 U1.47 52.63,48.97 50.16,51.44 v50.16,54.61 | U1.18 64.21,41.84 64.14,41.91 59.21,41.91 | v50.16,61.59 43.51,61.59 42.87,60.96 | U1.12 69.37,43.97 71.12,45.72 75.56,45.72 79.38,45.72 80.01,45.09 80.01,43.81 | 80.01,43.81 80.64,43.18 | 83.19,43.18 83.19,22.23 | 78.74,17.78 75.56,17.78 75.56,15.24 75.56,13.97 | U1.63 64.21,54.05 65.41,55.24 65.41,59.05 64.14,60.33 D-V33.A 61.59,60.33 61.59,60.96 60.33,62.23 60.33,66.04 | 80.01,55.24 80.01,55.38 C-X8B.1
  Bottom 0.406: 80.01,55.24 81.28,53.98 81.28,52.07 80.64,51.44 78.74,51.44 78.11,52.07 76.83,52.07 75.56,50.8 75.56,45.72
  Bottom 0.61: C-CLT.2 75.69,17.76 R-CLT2.1 78.74,17.78 83.19,22.23 83.19,27.3 | R-TPS2.1 75.69,41.25 C-TPS.2 76.2,38.73 78.11,36.83 82.55,36.83 83.19,37.47 | 83.19,37.47 83.19,43.18 80.64,43.18 80.54,43.18 ANALOG.2 | R-MAP2.1 76.2,33.02 78.11,31.11 82.55,31.11 83.19,31.75 | 83.19,31.75 83.19,37.47 | R-MAT2.1 76.83,25.4 78.11,26.67 82.55,26.67 83.19,27.3 | 83.19,27.3 83.19,31.75 | TR-ICU.E 53.02,29.66 C-ICU.2 52.55,29.19 R-ICU2.1 52.07,26.67 49.53,24.13 49.53,20.32 51.44,18.41 57.15,18.41 62.23,18.41 63.5,19.68 63.5,22.81 PULSER.2 | C-VDDO.2 39.24,20.68 TR-VDDO.E | C-X8B.1 C-X8A.1 79.5,58.42 80.64,58.42 81.28,59.05 81.28,62.23 80.14,63.37 C-X32B.1 | C-VDD.- 60.47,62.43 D-V33.A 61.59,59.35 BOOT.3 | 75.56,15.24 75.56,13.34 74.93,12.7 69.85,12.7 67.94,14.61 57.15,14.61 56.83,14.92 | 60.33,66.04 60.33,68.58 55.88,73.03 52.07,73.03 50.16,71.12 v50.16,61.59 | D-V12.A 84.16,66.04 C-X32A.1 80.14,67.81 80.01,67.94 72.39,67.94 71.75,68.58 71.75,71.72 IC2.3
  Bottom 0.813: D-V12.A C-VCC.-